# Altium schematic sheet SERVO-Outputs.SchDoc: OpenSCB: SERVO Outputs
size A4; Organization: OpenSCB; Revision: 0.2; SheetNumber: 2; SheetTotal: 4
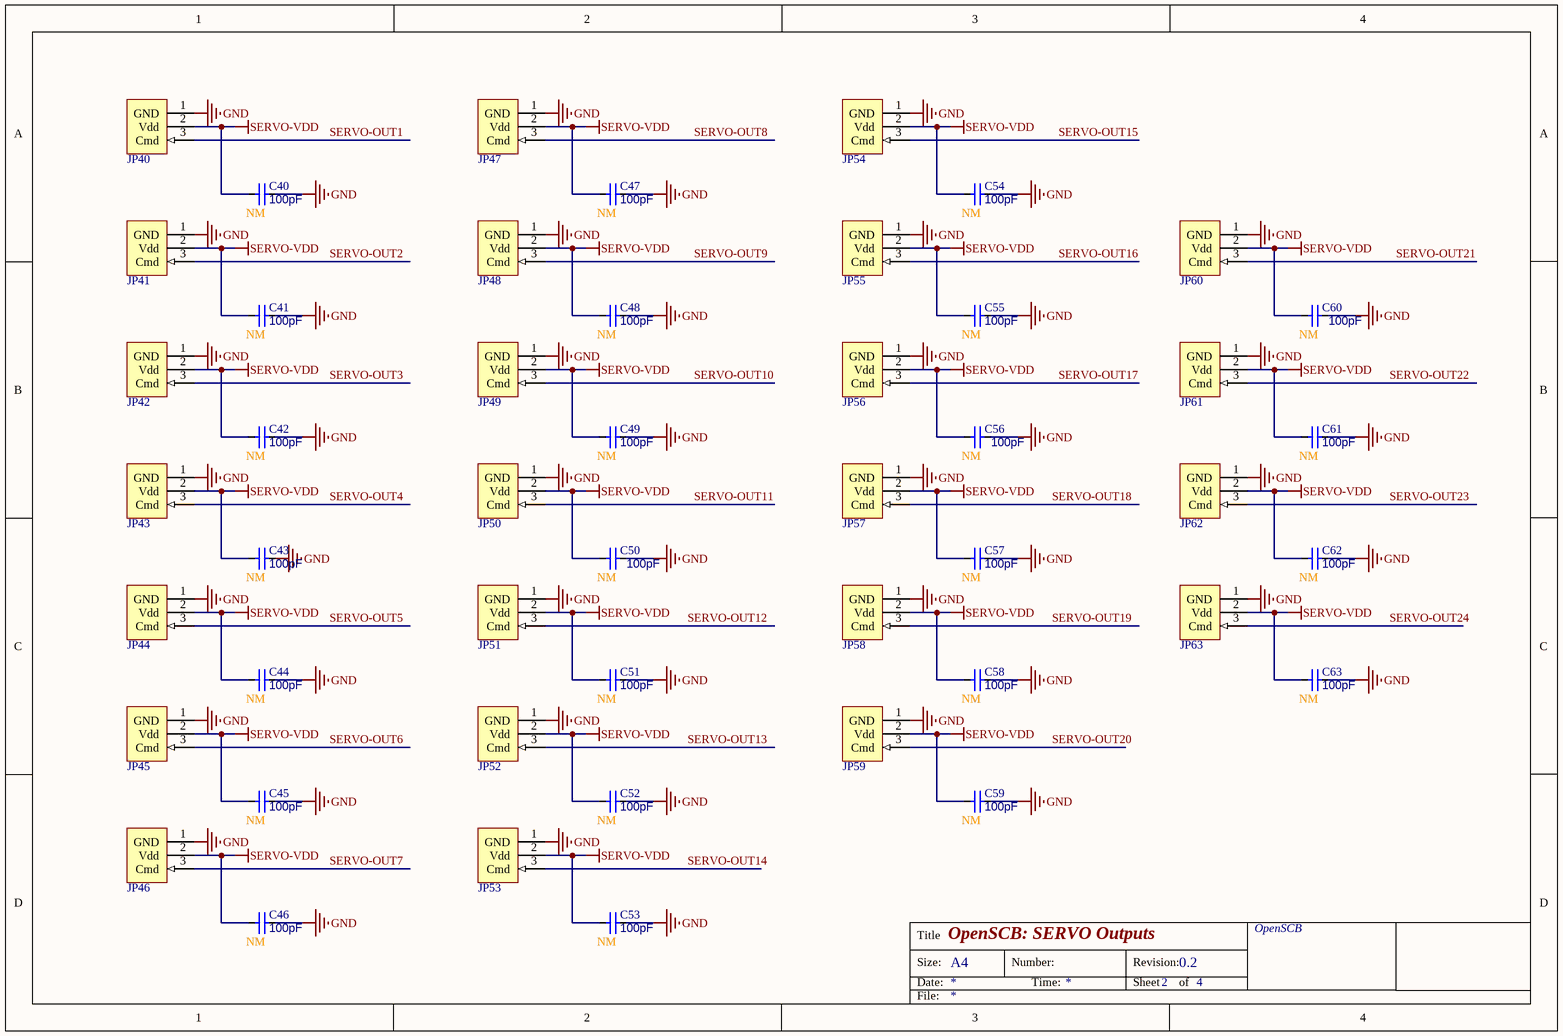
[diagram p0: SERVO-Outputs.SchDoc]

## Parts
C40  value 100pF  [CC1005-0402]  (hidden comment: Condensateur)
C41  value 100pF  [CC1005-0402]  (hidden comment: Condensateur)
C42  value 100pF  [CC1005-0402]  (hidden comment: Condensateur)
C43  value 100pF  [CC1005-0402]  (hidden comment: Condensateur)
C44  value 100pF  [CC1005-0402]  (hidden comment: Condensateur)
C45  value 100pF  [CC1005-0402]  (hidden comment: Condensateur)
C46  value 100pF  [CC1005-0402]  (hidden comment: Condensateur)
C47  value 100pF  [CC1005-0402]  (hidden comment: Condensateur)
C48  value 100pF  [CC1005-0402]  (hidden comment: Condensateur)
C49  value 100pF  [CC1005-0402]  (hidden comment: Condensateur)
C50  value 100pF  [CC1005-0402]  (hidden comment: Condensateur)
C51  value 100pF  [CC1005-0402]  (hidden comment: Condensateur)
C52  value 100pF  [CC1005-0402]  (hidden comment: Condensateur)
C53  value 100pF  [CC1005-0402]  (hidden comment: Condensateur)
C54  value 100pF  [CC1005-0402]  (hidden comment: Condensateur)
C55  value 100pF  [CC1005-0402]  (hidden comment: Condensateur)
C56  value 100pF  [CC1005-0402]  (hidden comment: Condensateur)
C57  value 100pF  [CC1005-0402]  (hidden comment: Condensateur)
C58  value 100pF  [CC1005-0402]  (hidden comment: Condensateur)
C59  value 100pF  [CC1005-0402]  (hidden comment: Condensateur)
C60  value 100pF  [CC1005-0402]  (hidden comment: Condensateur)
C61  value 100pF  [CC1005-0402]  (hidden comment: Condensateur)
C62  value 100pF  [CC1005-0402]  (hidden comment: Condensateur)
C63  value 100pF  [CC1005-0402]  (hidden comment: Condensateur)
JP40  SERVO Connector  [PinHead-3pts]  (value not drawn)
JP41  SERVO Connector  [PinHead-3pts]  (value not drawn)
JP42  SERVO Connector  [PinHead-3pts]  (value not drawn)
JP43  SERVO Connector  [PinHead-3pts]  (value not drawn)
JP44  SERVO Connector  [PinHead-3pts]  (value not drawn)
JP45  SERVO Connector  [PinHead-3pts]  (value not drawn)
JP46  SERVO Connector  [PinHead-3pts]  (value not drawn)
JP47  SERVO Connector  [PinHead-3pts]  (value not drawn)
JP48  SERVO Connector  [PinHead-3pts]  (value not drawn)
JP49  SERVO Connector  [PinHead-3pts]  (value not drawn)
JP50  SERVO Connector  [PinHead-3pts]  (value not drawn)
JP51  SERVO Connector  [PinHead-3pts]  (value not drawn)
JP52  SERVO Connector  [PinHead-3pts]  (value not drawn)
JP53  SERVO Connector  [PinHead-3pts]  (value not drawn)
JP54  SERVO Connector  [PinHead-3pts]  (value not drawn)
JP55  SERVO Connector  [PinHead-3pts]  (value not drawn)
JP56  SERVO Connector  [PinHead-3pts]  (value not drawn)
JP57  SERVO Connector  [PinHead-3pts]  (value not drawn)
JP58  SERVO Connector  [PinHead-3pts]  (value not drawn)
JP59  SERVO Connector  [PinHead-3pts]  (value not drawn)
JP60  SERVO Connector  [PinHead-3pts]  (value not drawn)
JP61  SERVO Connector  [PinHead-3pts]  (value not drawn)
JP62  SERVO Connector  [PinHead-3pts]  (value not drawn)
JP63  SERVO Connector  [PinHead-3pts]  (value not drawn)

## Nets
GND: C40.1 C41.1 C42.1 C43.1 C44.1 C45.1 C46.1 C47.1 C48.1 C49.1 C50.1 C51.1 C52.1 C53.1 C54.1 C55.1 C56.1 C57.1 C58.1 C59.1 C60.1 C61.1 C62.1 C63.1 JP40.1(GND) JP41.1(GND) JP42.1(GND) JP43.1(GND) JP44.1(GND) JP45.1(GND) JP46.1(GND) JP47.1(GND) JP48.1(GND) JP49.1(GND) JP50.1(GND) JP51.1(GND) JP52.1(GND) JP53.1(GND) JP54.1(GND) JP55.1(GND) JP56.1(GND) JP57.1(GND) JP58.1(GND) JP59.1(GND) JP60.1(GND) JP61.1(GND) JP62.1(GND) JP63.1(GND)
SERVO-VDD: C40.2 C41.2 C42.2 C43.2 C44.2 C45.2 C46.2 C47.2 C48.2 C49.2 C50.2 C51.2 C52.2 C53.2 C54.2 C55.2 C56.2 C57.2 C58.2 C59.2 C60.2 C61.2 C62.2 C63.2 JP40.2(Vdd) JP41.2(Vdd) JP42.2(Vdd) JP43.2(Vdd) JP44.2(Vdd) JP45.2(Vdd) JP46.2(Vdd) JP47.2(Vdd) JP48.2(Vdd) JP49.2(Vdd) JP50.2(Vdd) JP51.2(Vdd) JP52.2(Vdd) JP53.2(Vdd) JP54.2(Vdd) JP55.2(Vdd) JP56.2(Vdd) JP57.2(Vdd) JP58.2(Vdd) JP59.2(Vdd) JP60.2(Vdd) JP61.2(Vdd) JP62.2(Vdd) JP63.2(Vdd)
SERVO-OUT1: JP40.3(Cmd)
SERVO-OUT2: JP41.3(Cmd)
SERVO-OUT3: JP42.3(Cmd)
SERVO-OUT4: JP43.3(Cmd)
SERVO-OUT5: JP44.3(Cmd)
SERVO-OUT6: JP45.3(Cmd)
SERVO-OUT7: JP46.3(Cmd)
SERVO-OUT8: JP47.3(Cmd)
SERVO-OUT9: JP48.3(Cmd)
SERVO-OUT10: JP49.3(Cmd)
SERVO-OUT11: JP50.3(Cmd)
SERVO-OUT12: JP51.3(Cmd)
SERVO-OUT13: JP52.3(Cmd)
SERVO-OUT14: JP53.3(Cmd)
SERVO-OUT15: JP54.3(Cmd)
SERVO-OUT16: JP55.3(Cmd)
SERVO-OUT17: JP56.3(Cmd)
SERVO-OUT18: JP57.3(Cmd)
SERVO-OUT19: JP58.3(Cmd)
SERVO-OUT20: JP59.3(Cmd)
SERVO-OUT21: JP60.3(Cmd)
SERVO-OUT22: JP61.3(Cmd)
SERVO-OUT23: JP62.3(Cmd)
SERVO-OUT24: JP63.3(Cmd)

## Notes on the sheet
- Title
- Size:
- Date:
- A4
- Number:
- Time:
- Revision:
- Sheet
- of
- File:

## Library data of the parts
JP40-JP63 = SERVO-Connector
C40-C63 = Condensateur: Revision: July-2002: Re-released for DXP Platform.; NM: NM